# Altium schematic sheet Communication.SchDoc
size A4
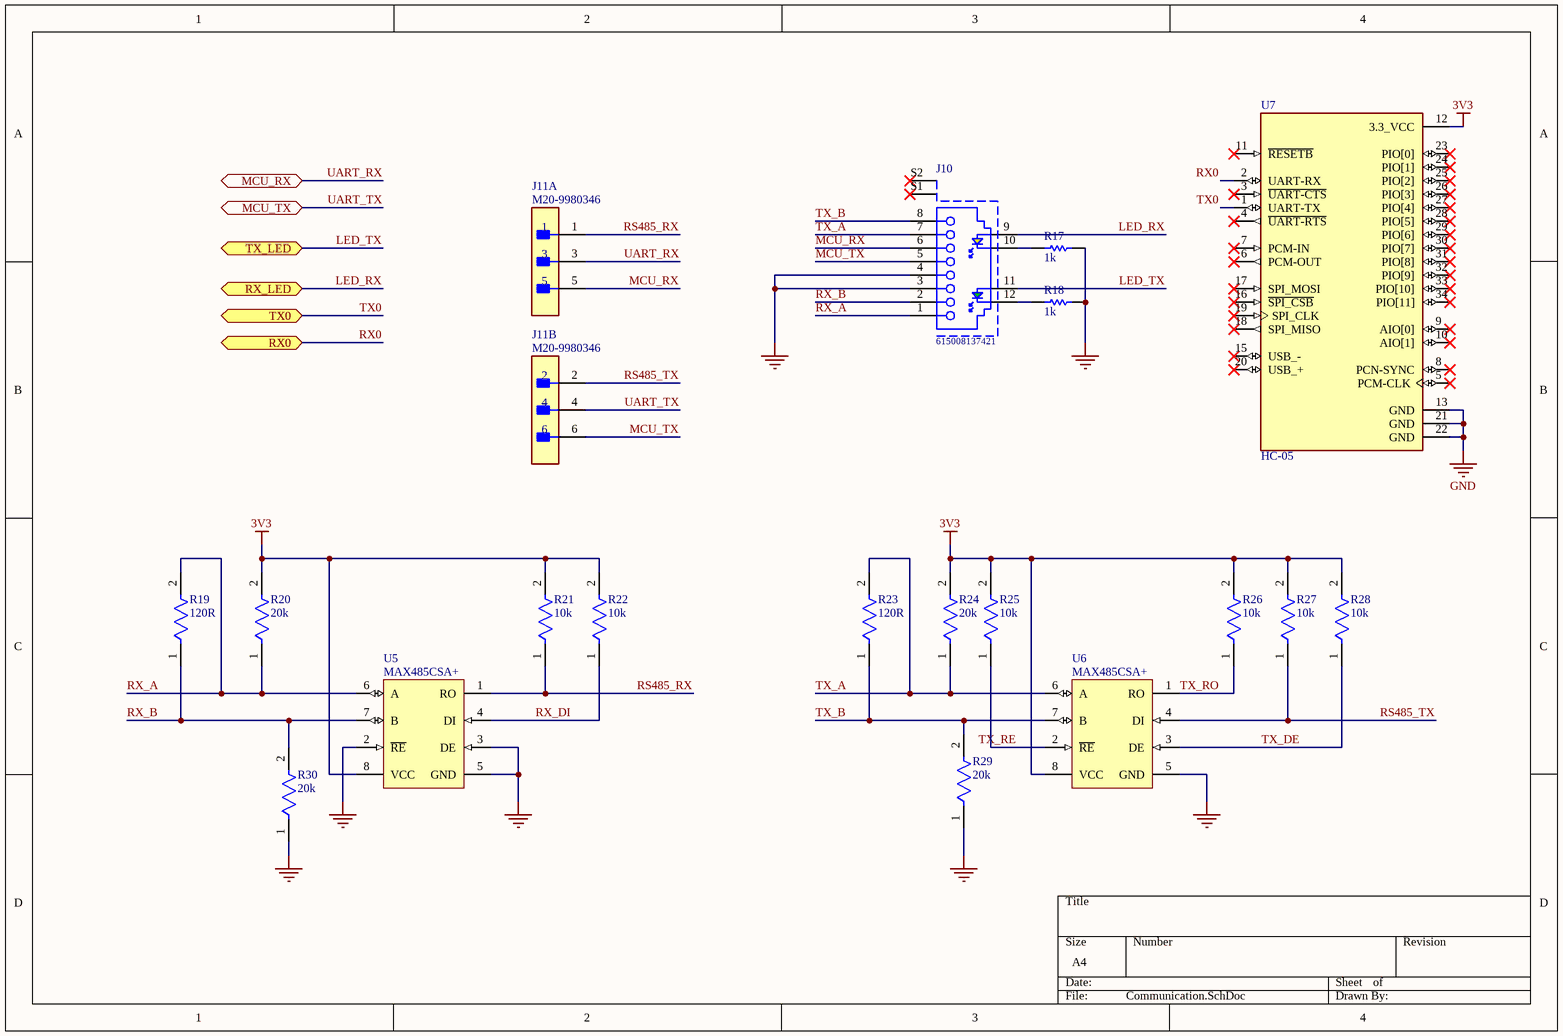
[diagram p0: Communication.SchDoc]

## Parts
J10  615008137421  [615008137421]
J11  M20-9980346  [FP-M20-9980346-MFG]  (parts A,B of 2)
R17  1k  [RESC2013X60X35ML10T20]
R18  1k  [RESC2013X60X35ML10T20]
R19  120R  [FP-CRCW0805-e3-IPC_A]
R20  20k  [FP-CRCW0805-e3-IPC_A]
R21  10k  [FP-CRCW0805-e3-IPC_A]
R22  10k  [FP-CRCW0805-e3-IPC_A]
R23  120R  [FP-CRCW0805-e3-IPC_A]
R24  20k  [FP-CRCW0805-e3-IPC_A]
R25  10k  [FP-CRCW0805-e3-IPC_A]
R26  10k  [FP-CRCW0805-e3-IPC_A]
R27  10k  [FP-CRCW0805-e3-IPC_A]
R28  10k  [FP-CRCW0805-e3-IPC_A]
R29  20k  [FP-CRCW0805-e3-IPC_A]
R30  20k  [FP-CRCW0805-e3-IPC_A]
U5  MAX485CSA+  [MAXM-MAX485CSA+-8_M]
U6  MAX485CSA+  [MAXM-MAX485CSA+-8_M]
U7  HC-05  [XCVR_HC-05]

## Ports
MCU_RX (bidir), MCU_TX (bidir), RX0 (bidir), RX_LED (bidir), TX0 (bidir), TX_LED (bidir)

## Nets
3V3: R20.2 R21.2 R22.2 R24.2 R25.2 R26.2 R27.2 R28.2 U5.8(VCC) U6.8(VCC) U7.12(3.3_VCC)
GND: J10.3 J10.4 R17.2 R18.2 R29.1 R30.1 U5.2(~{RE}) U5.3(DE) U5.5(GND) U6.5(GND) U7.13(GND) U7.21(GND) U7.22(GND)
LED_RX: J10.9 ; port RX_LED
LED_TX: J10.11 ; port TX_LED
MCU_RX: J10.6 J11.5
MCU_TX: J10.5 J11.6
RS485_RX: J11.1 R21.1 U5.1(RO)
RS485_TX: J11.2 R27.1 U6.4(DI)
RX0: U7.2(UART-RX) ; port RX0
RX_A: J10.1 R19.2 R20.1 U5.6(A)
RX_B: J10.2 R19.1 R30.2 U5.7(B)
RX_DI: R22.1 U5.4(DI)
TX0: U7.1(UART-TX) ; port TX0
TX_A: J10.7 R23.2 R24.1 U6.6(A)
TX_B: J10.8 R23.1 R29.2 U6.7(B)
TX_DE: R28.1 U6.3(DE)
TX_RE: R25.1 U6.2(~{RE})
TX_RO: R26.1 U6.1(RO)
UART_RX: J11.3 ; port MCU_RX
UART_TX: J11.4 ; port MCU_TX
NetJ10_10: J10.10 R17.1
NetJ10_12: J10.12 R18.1

Not connected (* = marked no-connect by the designer): J10 S1* S2*; U7 3(~{UART-CTS})* 4(~{UART-RTS})* 5(PCM-CLK)* 6(PCM-OUT)* 7(PCM-IN)* 8(PCN-SYNC)* 9(AIO[0])* 10(AIO[1])* 11(~{RESETB})* 15(USB_-)* 16(~{SPI_CSB})* 17(SPI_MOSI)* 18(SPI_MISO)* 19(SPI_CLK)* 20(USB_+)* 23(PIO[0])* 24(PIO[1])* 25(PIO[2])* 26(PIO[3])* 27(PIO[4])* 28(PIO[5])* 29(PIO[6])* 30(PIO[7])* 31(PIO[8])* 32(PIO[9])* 33(PIO[10])* 34(PIO[11])*

## Library data of the parts
J10 = CMP-1502-01697-1: Modular Jack WR-MJ, Tab Up, Shielded, with LED and EMI Panel Finger, Horizontal Entry, THT, 8P8C; Manufacturer: Wurth Elektronik; Compliance: Leadfree/RoHS; Withstanding Voltage: 1000VAC; Port: 1x1; Contact Resistance: 20mOhm; Rated Current: 1.5A; Working Voltage: 120VAC; Manufacturer URL: http://www.we-online.de; Mounting Technology: THT; Entrance: Horizontal; Datasheet URL: https://katalog.we-online.de/em/datasheet/615008137421.pdf; Packaging: Tray; Package Reference: 615008137421; Publisher: WurthElektronik; Operating Temperature: -40to85degC; Part Number: 615008137421; Pin Number: 8P8C
J11 = CMP-2000-06636-2: CONN HEADER VERT 6POS 2.54MM; Manufacturer: Harwin; Current Rating: 3A; Number Of Contacts: 6; Conn Gender: Male; Conn Orientation: Vertical; Device Class L1: Connectors; ComponentLink2Description: Datasheet; Height: 8.99mm; Temperature Range High: +105°C; Contact Material: Tin,Nickel; RoHS: TRUE; Temperature Range Low: -40°C; ComponentLink2URL: https://cdn.harwin.com/pdfs/M20-998.pdf; Digikey Description: CONN HEADER VERT 6POS 2.54MM; Pitch: 2.54mm; Package: M20-9980346; Device Class L2: Headers and Wire Housings; Manufacturer Part Number: M20-9980346; Number Of Rows: 2; Category: Conn; Lead Free: Yes; Mouser Description: 2.54mm (0.1") Pitch DIL Vertical PC Tail Pin Header, 6.1mm mating pin height, tin, 3+3 contacts; Temperature: -40°C to +105°C; Device Class L3: unset; Octopart: https://octopart.com/m20-9980346-harwin-5436545; Automotive: No
R17 R18 = CMP-2100-03671-1: Chip Resistor, 1 KOhm, +/- 1%, 125 mW, -55 to 155 degC, 0805 (2012 Metric), RoHS, Tape and Reel; Manufacturer: Yageo; Temperature Coefficient: 100ppm/degreesC; Voltage Rating (DC): 150V; Max Power Dissipation: 125mW; Resistance: 1KOhm; Number of Pins: 2; Number of Terminations: 2; Datasheet URL: http://www.yageo.com/NewPortal/yageodocoutput?fileName=/pdf/R-Chip/PYu-RC_Group_51_RoHS_L_5.pdf; Length: 0.079inch; Package Description: 2-Pin Surface Mounted Device, Body 2 x 1.25 mm; Depth: 1.25mm; Height: 0.024inch; Military Standard: Not; Case/Package: 0805; Package Reference: 0805; RoHSCompliant: true; Lead Free: LeadFree; Packaging: TapeandReel; Package Quantity: 1; Datasheet Version: Rev. 5, 10/2016; Tolerance: 1%; Min Operating Temperature: -55degC; Voltage Rating: 150V; Composition: ThickFilm; Case Code (Imperial): 0805; Power Rating: 125mW; Width: 0.049inch; Case Code (Metric): 2012; Manufacturer URL: http://www.yageo.com/; Max Operating Temperature: 155degC; REACH SVHC: Unknown; Termination: SMD/SMT
R19 R21-R23 R25-R28 = CMP-2001-04908-2: RES Thick Film, 10kΩ, 1%, 0.125W, 100ppm/°C, 0805; Resistance: 10kR; Voltage Rating (DC): 150V; Power Rating: 125mW; Weight: 0.000194oz; Package Quantity: 5000; Military Standard: Not; Max Operating Temperature: 155°C; Temperature Coefficient: 100ppm/°C; Contact Plating: Tin; Width: 1.25mm; Height: 0.45mm; Radiation Hardening: No; Tolerance: 1%; Min Operating Temperature: -55°C; Voltage Rating: 150V; Length: 2mm; Depth: 1.25mm; Termination: SMD/SMT; Packaging: Tape and Reel; Case/Package: 0805; Case Code (Metric): 2012; Lead Free: Lead Free; Case Code (Imperial): 0805; Composition: Thick Film
R20 R24 R29 R30 = CMP-2001-04908-2: RES Thick Film, 20kΩ, 1%, 0.125W, 100ppm/°C, 0805; Resistance: 10kR; Voltage Rating (DC): 150V; Power Rating: 125mW; Weight: 0.000194oz; Package Quantity: 5000; Military Standard: Not; Max Operating Temperature: 155°C; Temperature Coefficient: 100ppm/°C; Contact Plating: Tin; Width: 1.25mm; Height: 0.45mm; Radiation Hardening: No; Tolerance: 1%; Min Operating Temperature: -55°C; Voltage Rating: 150V; Length: 2mm; Depth: 1.25mm; Termination: SMD/SMT; Packaging: Tape and Reel; Case/Package: 0805; Case Code (Metric): 2012; Lead Free: Lead Free; Case Code (Imperial): 0805; Composition: Thick Film
U5 U6 = CMP-2000-05211-1: Low-Power, Slew-Rate-Limited RS-485/RS-422 Transceiver, 4.75 to 5.25 V, 0 to 70 degC, 8-Pin SOIC, RoHS, Tape and Reel; Manufacturer: Maxim; No. of Receivers: 1; Transceiver Type: Differential; Supply Voltage Min: 4.75V; IC Generic Number: 485; IC Temperature Range: Commercial; No. of Pins: 8; Supply Voltage Range: 4.75Vto5.25V; Interface: RS-422/RS-485; Supply Voltage Max: 5.25V; Data Rate: 2.5Mbps; Line / Bus Driver / Receiver / Transceiver Type: CMOSDifferential; Supply Current: 500µA; Interface Type: RS422,RS485; Device Type: Transceiver; Manufacturer URL: http://www.maximintegrated.com/; Operating Temperature Range: 0degCto+70degC; Package / Case: SOIC; Digital IC Case Style: SOIC; Operating Temperature Max: 70degC; Device Marking: MAX485CSA+; Driver Case Style: SOIC; Datasheet Version: Rev. 8, 10/2003; Operating Temperature Min: 0degC; Datasheet URL: https://datasheet.ciiva.com/29306/170071-da-01-en-ic-max485csa-so8-29306144.pdf; Base Number: 485; No. of Drivers: 1; Logic Function Number: 485
U7 = HC-05: Bluetooth to Serial Port Module; MF: ITead Studio; SnapEDA_Link: https://www.snapeda.com/parts/HC-05/ITEAD/view-part/?ref=snap; Package: Module ITead Studio; Value: *; MP: HC-05; Check_prices: https://www.snapeda.com/parts/HC-05/ITEAD/view-part/?ref=eda